# EAGLE design ADJD-S311_Breakout-v10 (EAGLE 5.06)
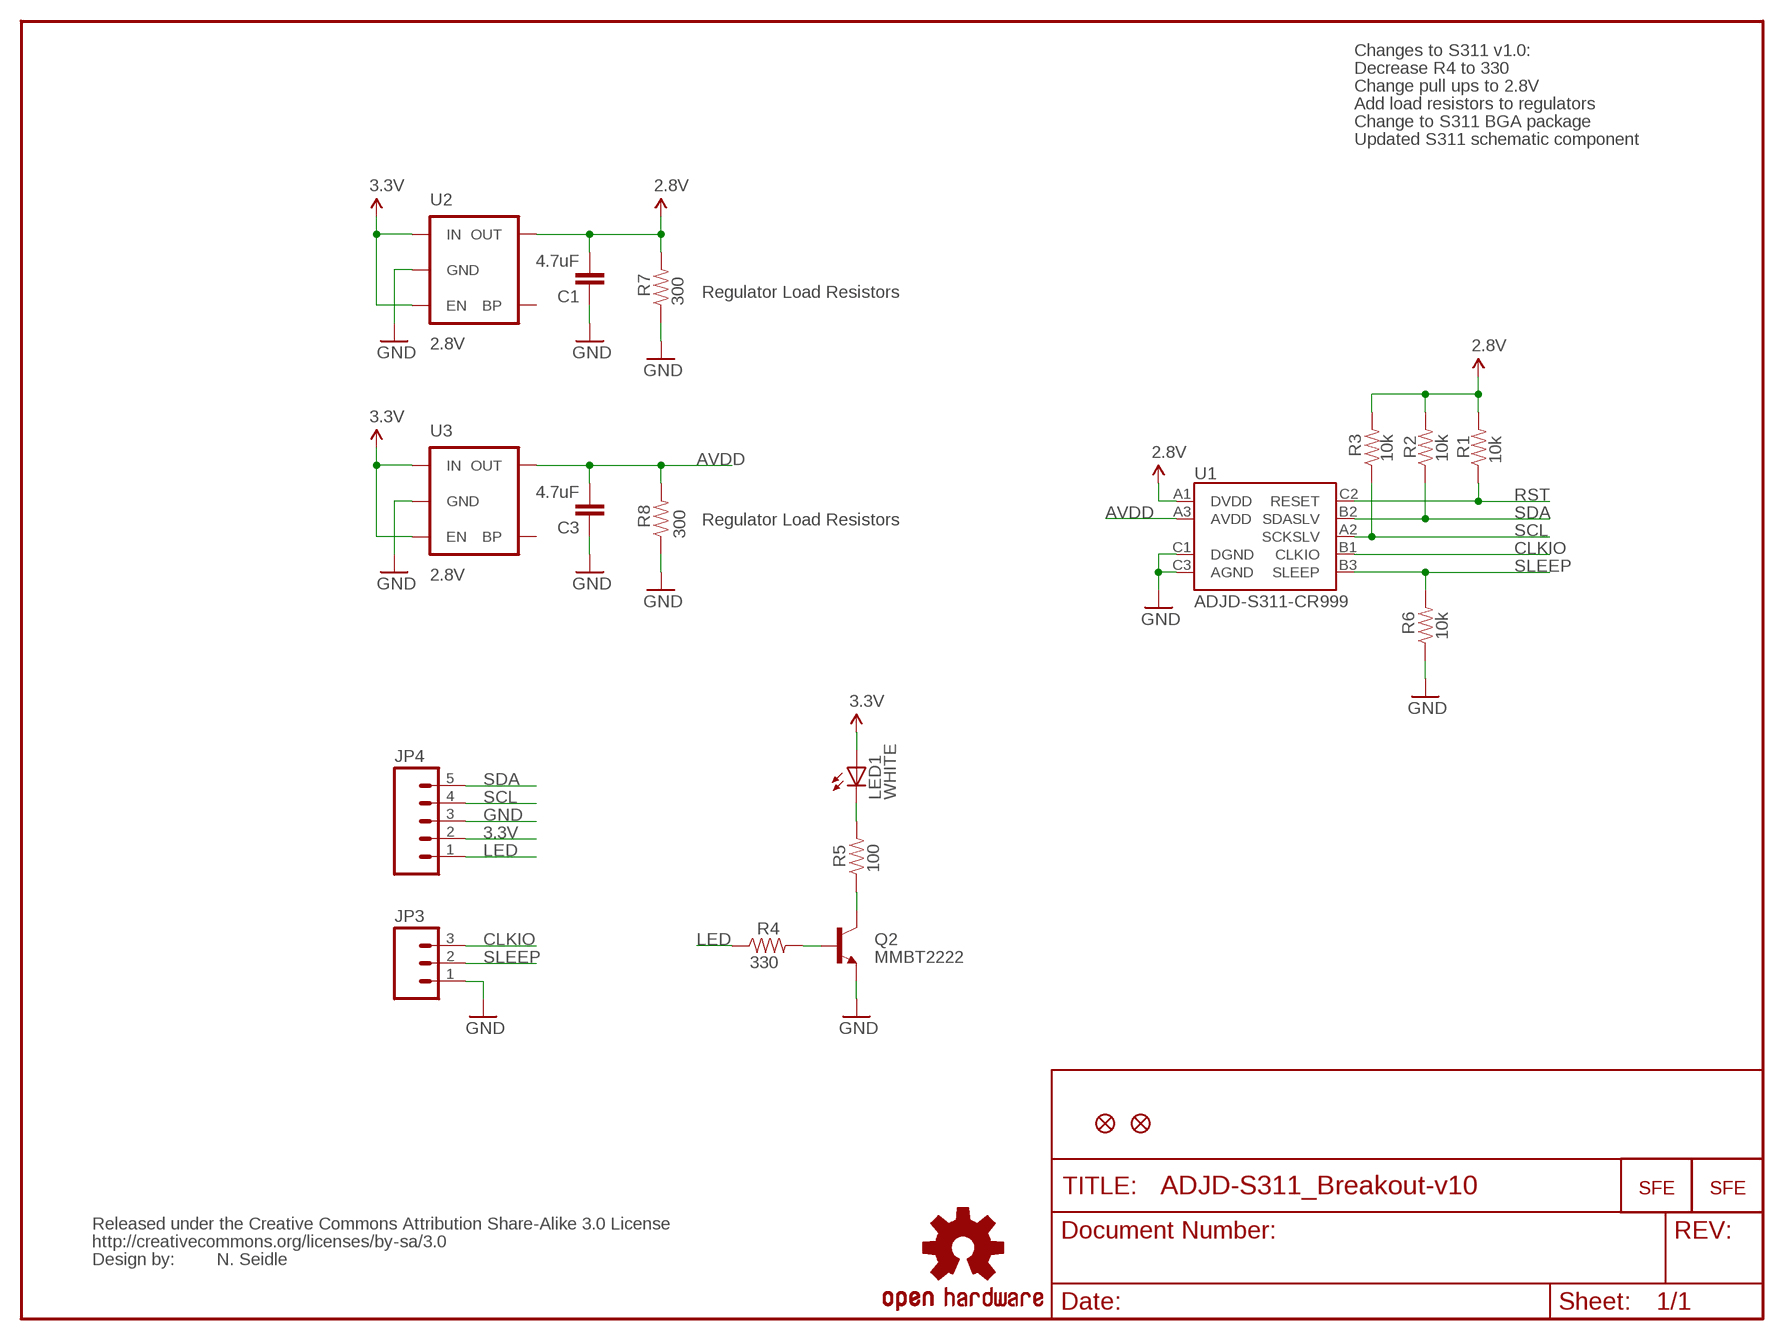
[diagram p0: schematic, sheet 1]

## Parts
C1  4.7uF  CAP0402-CAP  [0402-CAP]
C3  4.7uF  CAP0402-CAP  [0402-CAP]
JP1  LOGO-SFESK  [SFE-LOGO-FLAME]
JP2  LOGO-SFESK  [SFE-LOGO-FLAME]
JP3  M03PTH  [1X03]
JP4  M05PTH  [1X05]
JP5  FIDUCIAL1X2.5  [FIDUCIAL-1X2.5]
JP6  FIDUCIAL1X2.5  [FIDUCIAL-1X2.5]
LED1  WHITE  LED0603  [LED-0603]
Q2  MMBT2222  TRANSISTOR_NPNSOT23-3  [SOT23-3]
R1  10k  RESISTOR0402-RES  [0402-RES]
R2  10k  RESISTOR0402-RES  [0402-RES]
R3  10k  RESISTOR0402-RES  [0402-RES]
R4  330  RESISTOR0402-RES  [0402-RES]
R5  100  RESISTOR0402-RES  [0402-RES]
R6  10k  RESISTOR0402-RES  [0402-RES]
R7  300  RESISTOR0402-RES  [0402-RES]
R8  300  RESISTOR0402-RES  [0402-RES]
U1  ADJD-S311-CR999  [CSP-9]
U2  2.8V  V_REG_LDOSMD  [SOT23-5]
U3  2.8V  V_REG_LDOSMD  [SOT23-5]
U$1  CREATIVE_COMMONS  [CREATIVE_COMMONS]
U$4  OSHW-LOGOS  [OSHW-LOGO-S]

## Nets
2.8V: C1.2 R1.2 R2.2 R3.2 R7.2 U1.A1(DVDD) U2.5(OUT)
3.3V: JP4.2 LED1.A U2.1(IN) U2.3(EN) U3.1(IN) U3.3(EN)
AVDD: C3.2 R8.2 U1.A3(AVDD) U3.5(OUT)
CLKIO: JP3.3 U1.B1(CLKIO)
GND: C1.1 C3.1 JP3.1 JP4.3 Q2.2(E) R6.1 R7.1 R8.1 U1.C1(DGND) U1.C3(AGND) U2.2(GND) U3.2(GND)
LED: JP4.1 R4.1
N$1: LED1.C R5.2
N$2: Q2.3(C) R5.1
N$3: Q2.1(B) R4.2
RST: R1.1 U1.C2(RESET)
SCL: JP4.4 R3.1 U1.A2(SCKSLV)
SDA: JP4.5 R2.1 U1.B2(SDASLV)
SLEEP: JP3.2 R6.2 U1.B3(SLEEP)
Unconnected: U2.4(BP) U3.4(BP)

## Notes on the sheet
- Changes to S311 v1.0:
- Decrease R4 to 330
- Change pull ups to 2.8V
- Add load resistors to regulators
- Change to S311 BGA package
- Updated S311 schematic component
- Regulator Load Resistors
- Regulator Load Resistors
- N. Seidle

## Library data of the parts
C1 C3 = SparkFun:CAP: Capacitor Standard 0603 ceramic capacitor, and 0.1" leaded capacitor.
JP1 JP2 = SparkFun:LOGO-SFE: Spark Fun Electronics PCB Logo This is the standard Spark Fun Electronics PCB logo.
JP3 = SparkFun:M03: Header 3 Standard 3-pin 0.1" header. Use with straight break away headers (SKU : PRT-00116), right angle break away headers (PRT-00553), swiss pins (PRT-00743), machine pins (PRT-00117), and female headers (PRT-00115). Molex polarized connector foot print use with SKU : PRT-08232 with associated crimp pins and housings.
JP4 = SparkFun:M05: Header 5 Standard 5-pin 0.1" header. Use with straight break away headers (SKU : PRT-00116), right angle break away headers (PRT-00553), swiss pins (PRT-00743), machine pins (PRT-00117), and female headers (PRT-00115). Molex polarized connector foot print use with SKU : PRT-08230 with associated crimp pins and housings.
JP5 JP6 = abes:FIDUCIAL: Fiducial Alignment Points Various fiducial points for machine vision alignment.
LED1 = SparkFun:LED: LEDs Standard schematic elements and footprints for 5mm, 3mm, 1206, and 0603 sized LEDs. 5mm - Spark Fun Electronics SKU : COM-00529 (and others)
Q2 = SparkFun:TRANSISTOR_NPN: Transistor NPN BJT configuration in SOT23 package. MMBT2222 is the common NPN we use. Double check BCE configuration again layout.
R1-R8 = SparkFun:RESISTOR: Resistor Basic schematic elements and footprints for 0603, 1206, and PTH resistors.
U1 = ADJD-S311:ADJD-S311-CR999
U2 U3 = SparkFun:V_REG_LDO: Voltage Regulator LDO Standard 150mA LDO voltage regulator in SOT-23 layout. Micrel part MIC5205. BP (by-pass) pin is used to lower output noise with 470pF cap.
U$1 = SparkFun:CREATIVE_COMMONS
U$4 = SparkFun:OSHW-LOGO: Open Source Hardware Logo This logo indicates the piece of hardware it is found on incorporates a OSHW license and/or adheres to the definition of open source hardware found here: http://freedomdefined.org/OSHW

## Board
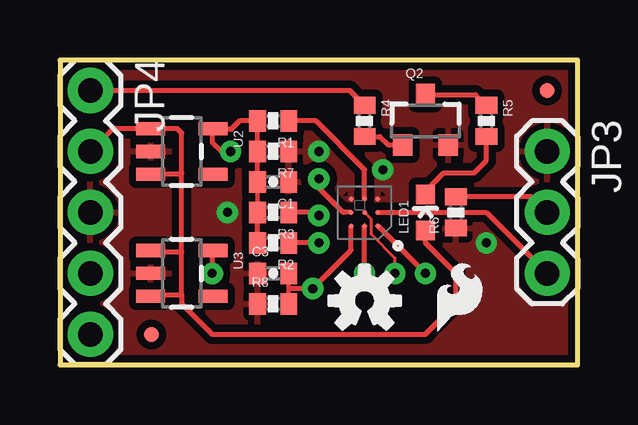
[diagram p1: board, top side]
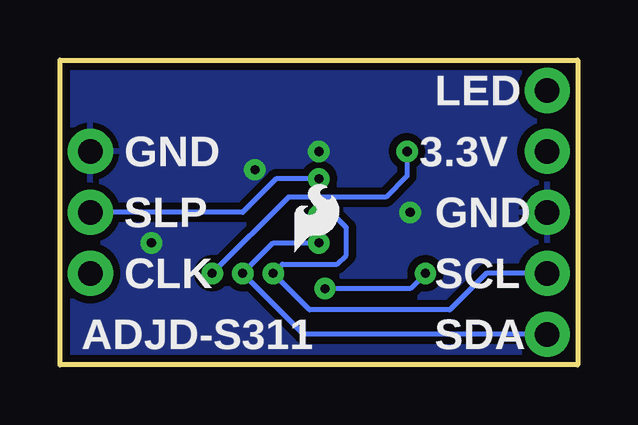
[diagram p2: board, bottom side, seen from below]

Size 21.59 x 12.7 mm. Coordinates in mm from the lower left corner, seen from the top.
Outline: 0,0 21.59,0 21.59,12.7 0,12.7 0,0
Copper layers (1*16): Top 0.035mm / dielectric 1.5mm / Bottom 0.035mm
Design rules "SparkFun *": minimum track width 5mil, minimum drill 15mil, track to track 4mil, track to pad 5mil, pad to pad 8mil, via to via 8mil, smd to smd 8mil, copper to edge 8mil, drill to drill 8mil, minimum pad ring 12mil, minimum via ring 10mil, stop-mask expansion 4mil, vias tented up to drill 20mil, thermal gap 10mil

### Footprints (pad centres in the part's own frame; a part is rotated, then mirrored left to right if it is on the bottom)
0402-CAP = smd 0.7 x 0.9: 1 -0.65,0; 2 0.65,0
1X03 = drill 1.016 pad 1.88 round: 1 0,0; 2 2.54,0; 3 5.08,0
1X05 = drill 1.016 pad 1.88 round: 1 0,0; 2 2.54,0; 3 5.08,0; 4 7.62,0; 5 10.16,0
FIDUCIAL-1X2.5 = smd 0.635 x 0.635: 1 0,0
LED-0603 = smd 0.8 x 0.8: A 0,-0.75; C 0,0.75
SOT23-3 = smd 0.8 x 0.9: 1 -0.95,-1; 2 0.95,-1; 3 0,1.1
0402-RES = smd 0.7 x 0.9: 1 -0.65,0; 2 0.65,0
CSP-9 = smd 0.2 x 0.2: A1 -0.56,0.56; A2 0,0.56; A3 0.56,0.56; B1 -0.56,0; B2 0,0; B3 0.56,0; C1 -0.56,-0.56; C2 0,-0.56; C3 0.56,-0.56
SOT23-5 = smd 0.55 x 1.2: 1 -0.95,-1.3; 2 0,-1.3; 3 0.95,-1.3; 4 0.95,1.3; 5 -0.95,1.3

### Placement (x,y rotation side)
C1  8.89,7.62 180 top
C3  8.89,3.81 0 top
JP1  11.81,4.7 0 bottom
JP2  15.75,1.4 0 top
JP3  20.32,8.89 270 top
JP4  1.27,11.43 270 top
JP5  3.81,1.27 0 top
JP6  20.32,11.43 0 top
LED1  15.24,6.35 0 top
Q2  15.24,10.16 0 top
R1  8.89,10.16 180 top
R2  8.89,5.08 180 top
R3  8.89,6.35 180 top
R4  12.7,10.16 270 top
R5  17.78,10.16 270 top
R6  16.51,6.35 90 top
R7  8.89,8.89 180 top
R8  8.89,2.54 0 top
U1  12.7,6.35 180 top
U2  5.08,8.89 270 top
U3  5.08,3.81 270 top
U$1  -15.24,-10.16 0 top  (outside the outline)
U$4  12.7,2.67 0 top

### Tracks (layer width: path | path; a pad name or v marks a point on that pad's centre or on a via)
2.8V  (via drill 0.38)
  Top 0.19: R3.2 C1.2
  Top 0.203: C1.2 R7.2 R1.2 7.49,10.16 7.14,9.81 6.35,9.81 | R2.2 R3.2 | v15.24,3.81 U1.A1 | v7.11,8.89 6.73,8.89 6.35,9.27 6.35,9.81 | 6.35,9.81 U2.5
  Bottom 0.203: v15.24,3.81 12.06,6.99 8,6.99 7.11,7.87 v7.11,8.89
3.3V
  Top 0.203: U3.1 3.84,4.7 5.08,4.7 | U3.3 3.84,2.92 5.08,2.92 | U2.3 5.02,7.94 5.08,8 | 5.08,4.7 5.08,8 | JP4.2 2.22,9.84 U2.1 4.89,9.84 5.08,9.65 5.08,8 | 5.08,2.92 5.08,4.7 | 5.08,2.92 5.08,2.54 6.35,1.27 15.24,1.27 16.51,2.54 16.51,3.81 15.24,5.08 LED1.A
AVDD  (via drill 0.38)
  Top 0.19: R8.2 9.54,3.17 C3.2
  Top 0.203: v6.35,3.81 6.35,4.73 U3.5 | U1.A3 12.14,4.77 v10.54,3.17 9.54,3.17
  Bottom 0.203: v10.54,3.17 6.99,3.17 v6.35,3.81
CLKIO
  Top 0.203: U1.B1 17.78,6.35 JP3.3
GND  (via drill 0.38)
  other vias: 10.79,8.89 13.46,8.13 17.78,5.08 6.99,6.35
  pour Bottom (isolate 0.305): 0,0 0,12.7 21.59,12.7 21.59,0
  pour Top (isolate 0.305): 0,0 0,12.7 21.59,12.7 21.59,0
LED
  Top 0.203: JP4.1 12.08,11.43 R4.1
N$1
  Top 0.203: LED1.C 15.24,7.24 16,8 17.27,8 17.78,8.51 R5.2
N$2
  Top 0.203: Q2.3 17.33,11.26 R5.1
N$3
  Top 0.203: R4.2 13.35,9.51 13.7,9.16 Q2.1
RST
  Top 0.203: R1.1 10.67,10.16 12.7,8.13 U1.C2
SCL  (via drill 0.38)
  Top 0.127: U1.A2 12.7,5.84
  Top 0.203: v12.7,3.81 U1.A2 | R3.1 10.67,6.35 v10.79,6.22
  Bottom 0.203: JP4.4 3.81,3.81 5.33,2.29 11.18,2.29 v12.7,3.81 12.32,4.19 10.03,4.19 9.65,4.57 9.65,5.71 10.16,6.22 v10.79,6.22
SDA  (via drill 0.38)
  Top 0.127: U1.B2 12.98,6.07 12.98,5.44 13.97,4.45 v13.97,3.81
  Top 0.203: v10.79,5.08 R2.1
  Bottom 0.203: JP4.5 11.43,1.27 v13.97,3.81 12.7,5.08 v10.79,5.08
SLEEP  (via drill 0.38)
  Top 0.203: R6.2 19.67,7 JP3.2 | U1.B3 11.81,6.35 10.79,7.37 v10.79,7.75
  Bottom 0.203: JP3.2 13.97,6.35 12.57,7.75 v10.79,7.75

### Text on the board
tPlace: N. Seidle
bPlace: LED | 3.3V | GND | GND | SLP | SCL | CLK | SDA | ADJD-S311